# Altium schematic sheet DriverBoard_DC.SchDoc
size 594 x 420 mm; DocumentNumber: Введите номер платы + Э3; SheetNumber: номер страницы; Format: A2
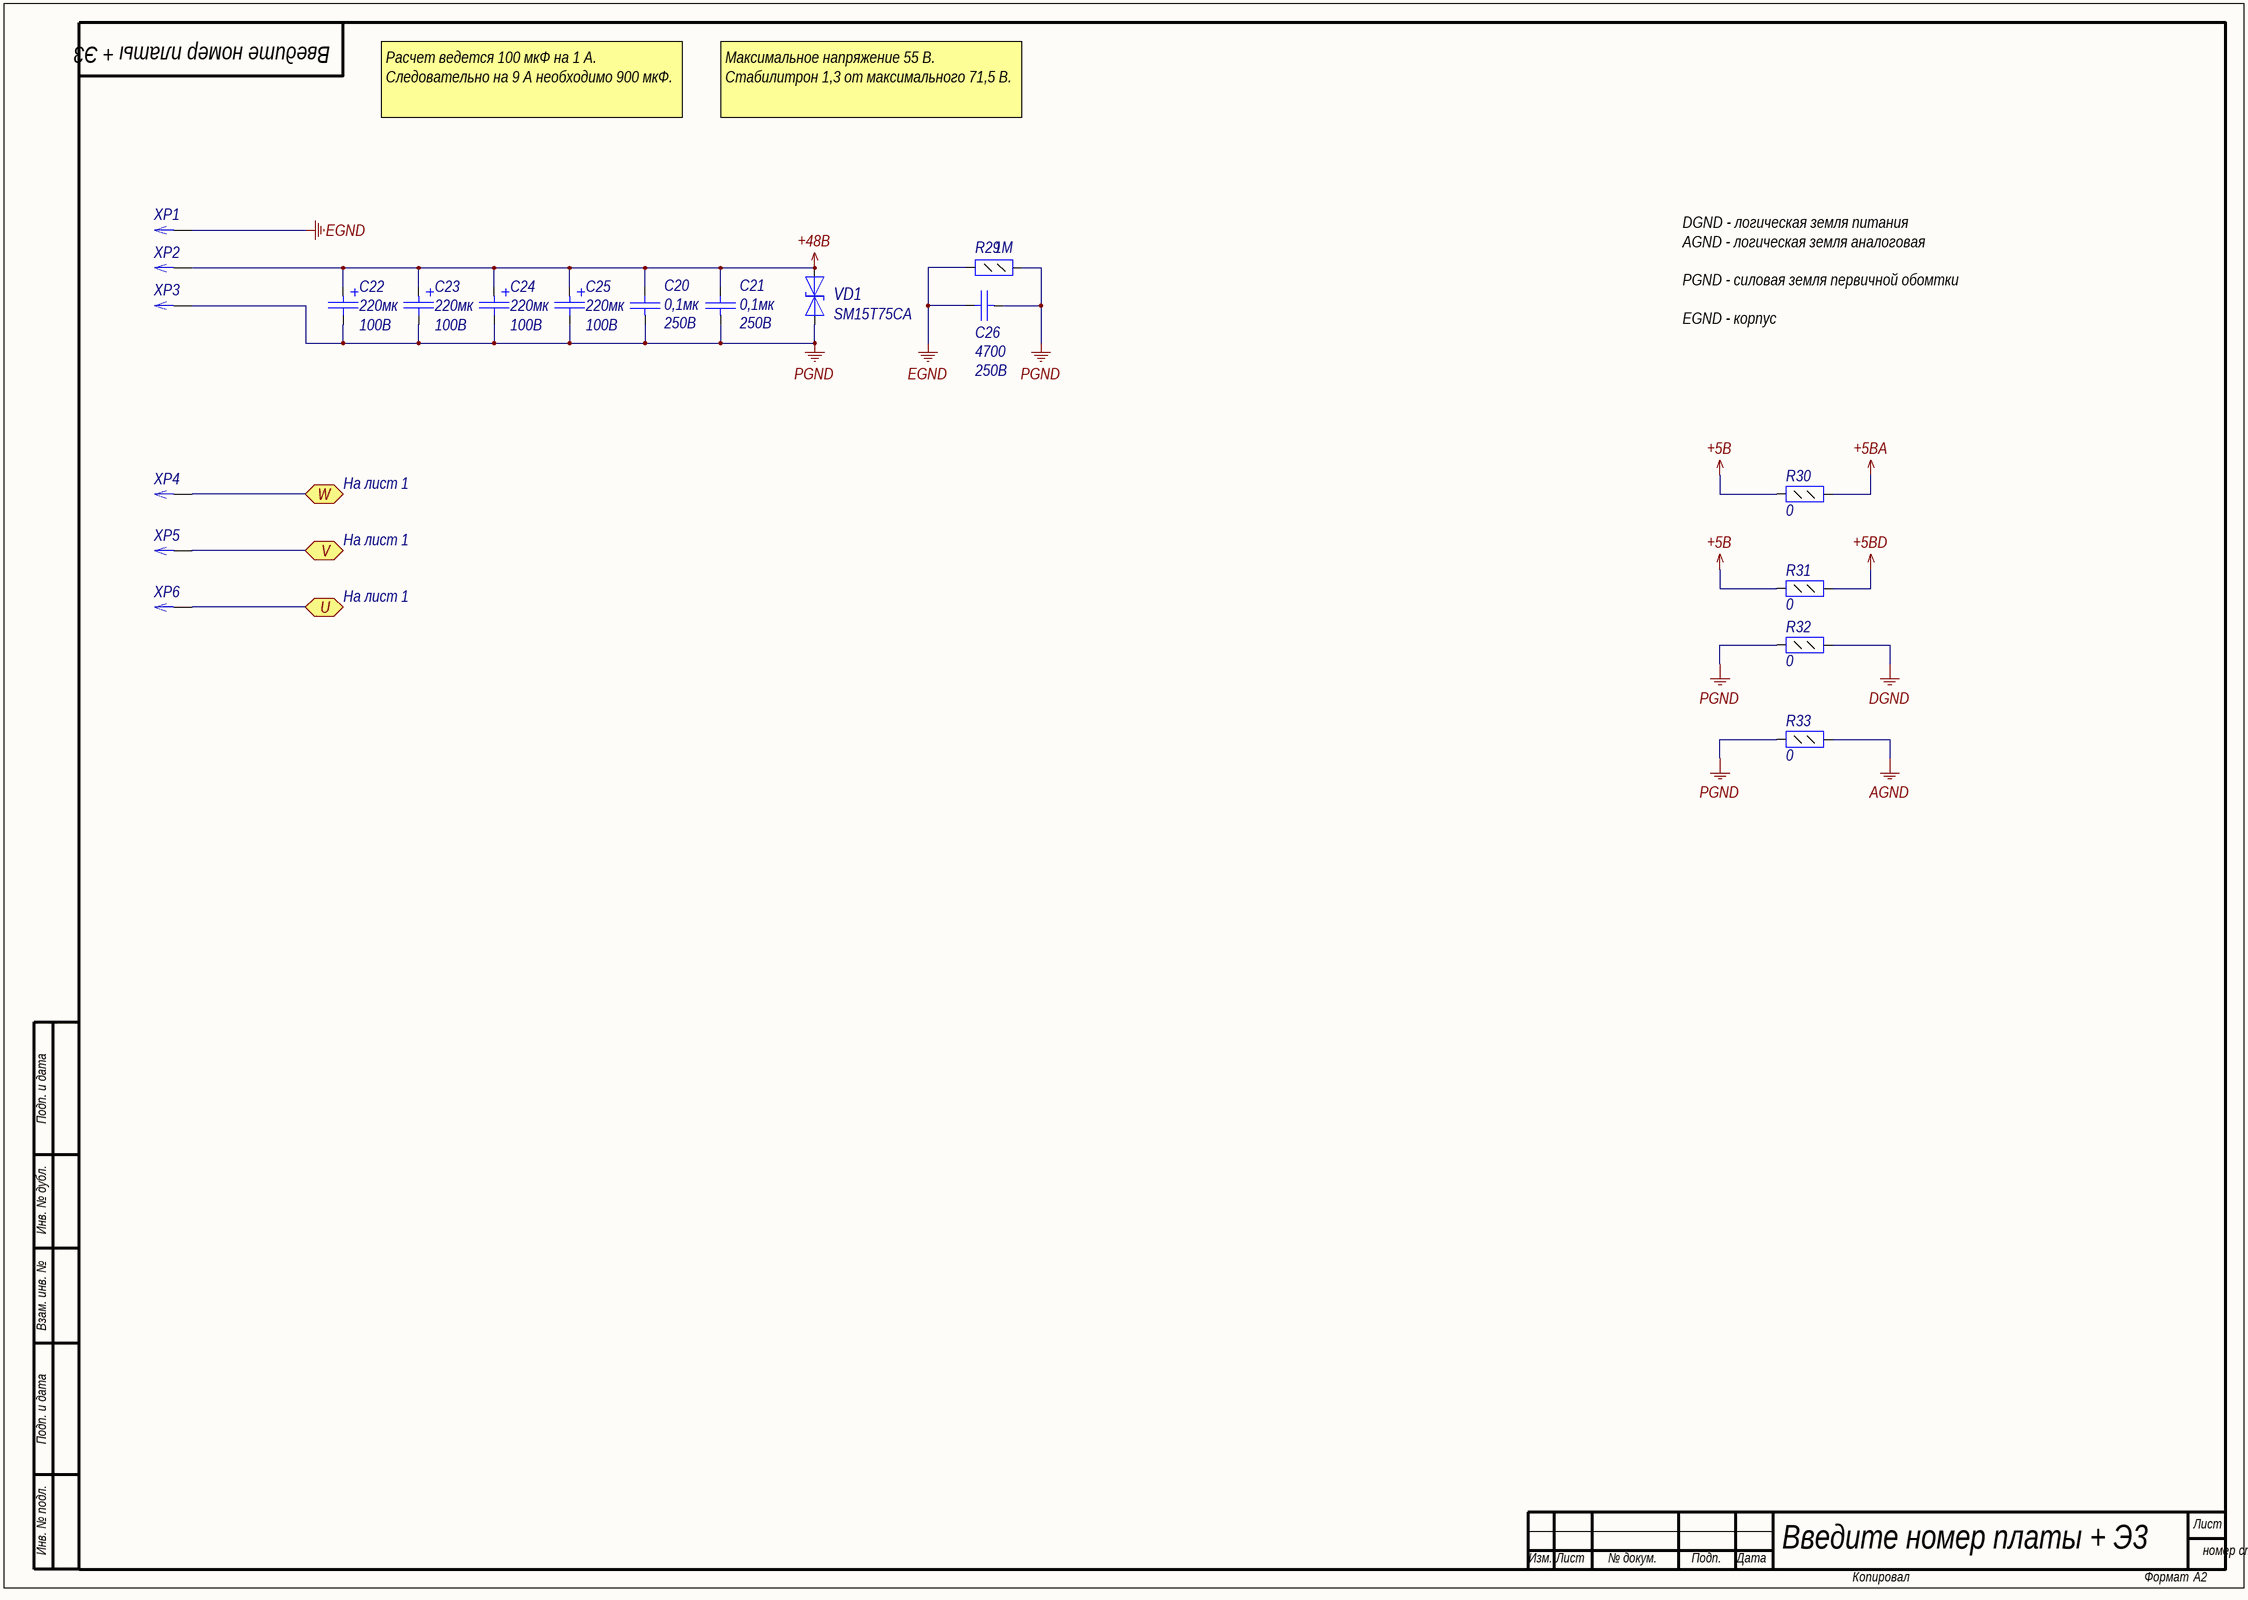
[diagram p0: DriverBoard_DC.SchDoc]

## Parts
C20  value 0,1мк  Voltage: 250В  [C1206]  (hidden comment: Capacitor)
C21  value 0,1мк  Voltage: 250В  [C1206]  (hidden comment: Capacitor)
C22  value 220мк  Voltage: 100B  [K50-35(12.5X25)_V]  (hidden comment: Capacitor_pol)
C23  value 220мк  Voltage: 100B  [K50-35(12.5X25)_V]  (hidden comment: Capacitor_pol)
C24  value 220мк  Voltage: 100B  [K50-35(12.5X25)_V]  (hidden comment: Capacitor_pol)
C25  value 220мк  Voltage: 100B  [K50-35(12.5X25)_V]  (hidden comment: Capacitor_pol)
C26  value 4700  Voltage: 250В  [C0805]  (hidden comment: Capacitor)
R29  value 1М  [R0805]  (hidden comment: Resistor_0,125Вт)
R30  value 0  [R0805]  (hidden comment: Resistor_0,125Вт)
R31  value 0  [R0805]  (hidden comment: Resistor_0,125Вт)
R32  value 0  [R0805]  (hidden comment: Resistor_0,125Вт)
R33  value 0  [R0805]  (hidden comment: Resistor_0,125Вт)
VD1  Part Number: SM15T75CA  [SMC]  (hidden comment: DiodeZenerDual)
XP1  Header_1_sct  [pin_ESKD]  (value not drawn)
XP2  Header_1_sct  [pin_ESKD]  (value not drawn)
XP3  Header_1_sct  [pin_ESKD]  (value not drawn)
XP4  Header_1_sct  [pin_ESKD]  (value not drawn)
XP5  Header_1_sct  [pin_ESKD]  (value not drawn)
XP6  Header_1_sct  [pin_ESKD]  (value not drawn)

## Ports
U, V, W

## Nets
+5B: R30.1 R31.1
+5BA: R30.2
+5BD: R31.2
+48B: C20.2 C21.2 C22.1 C23.1 C24.1 C25.1 VD1.2(A) XP2.1
AGND: R33.2
DGND: R32.2
EGND: C26.2 R29.2 XP1.1
PGND: C20.1 C21.1 C22.2 C23.2 C24.2 C25.2 C26.1 R29.1 R32.1 R33.1 VD1.1(K) XP3.1
U: XP6.1 ; port U
V: XP5.1 ; port V
W: XP4.1 ; port W

## Notes on the sheet
- Расчет ведется 100 мкФ на 1 А.
  Следовательно на 9 А необходимо 900 мкФ.
- Максимальное напряжение 55 В.
  Стабилитрон 1,3 от максимального 71,5 В.
- DGND - логическая земля питания
  AGND - логическая земля аналоговая
  PGND - силовая земля первичной обомтки
  EGND - корпус
- На лист 1
- Подп. и дата
- Инв. № дубл.
- Взам. инв. №
- Инв. № подл.
- Лист
- Изм.
- № докум.
- Подп.
- Дата
- Копировал
- Формат

## Library data of the parts
C20 C21 = cap179: Конденсатор; Part Name: Ceramic; Manufacture: Murata; Part Number: GRM31CR72E104K; id: cap179; TKE: X7R
C22-C25 = cap279: Конденсатор полярный; Part Name: Electrolit; Manufacture: Epcos; Part Number: B41851A9227M000; id: cap279; tga: 0,10%; ESR: 75мОм; Iac max: 0,4А; Iac rated: 0,6А
C26 = cap211: Конденсатор; Part Name: Ceramic; Manufacture: Murata; Part Number: GRM21AR72E472KW; id: cap211; TKE: X7R
R29 = res149: Резистор; Manufacture: Yageo; Part Number: RC0805FR-071ML; id: res149; Accuracy: 0,01; Part Name: Resistor; Power: 0,125Вт
R30-R33 = res0: Резистор; Manufacture: Yageo; Part Number: RC0805FR-070RL; id: res0; Accuracy: 0,01; Part Name: Resistor; Power: 0,125Вт
VD1 = SM15T75CA: Cтабилитрон (диод выпрямительный лавинный) двусторонний; Part Name: TVS diode Bidirectional; Manufacture: ST Microelectronics; id: tvs280; Leakage Current: 0.2uA; Stand-off Voltage: 71.3B; Breakdown Voltage: 75B; Clamping voltage: 78.8B; Peak Pulse Power: 1500W; Number of diodes: 1
XP1-XP6 = gconnect0: Штырь ГОСТ21.614-88; Part Name: pin 11,5; id: gconnect0